# Altium schematic sheet INTERFACE.SchDoc
size A4
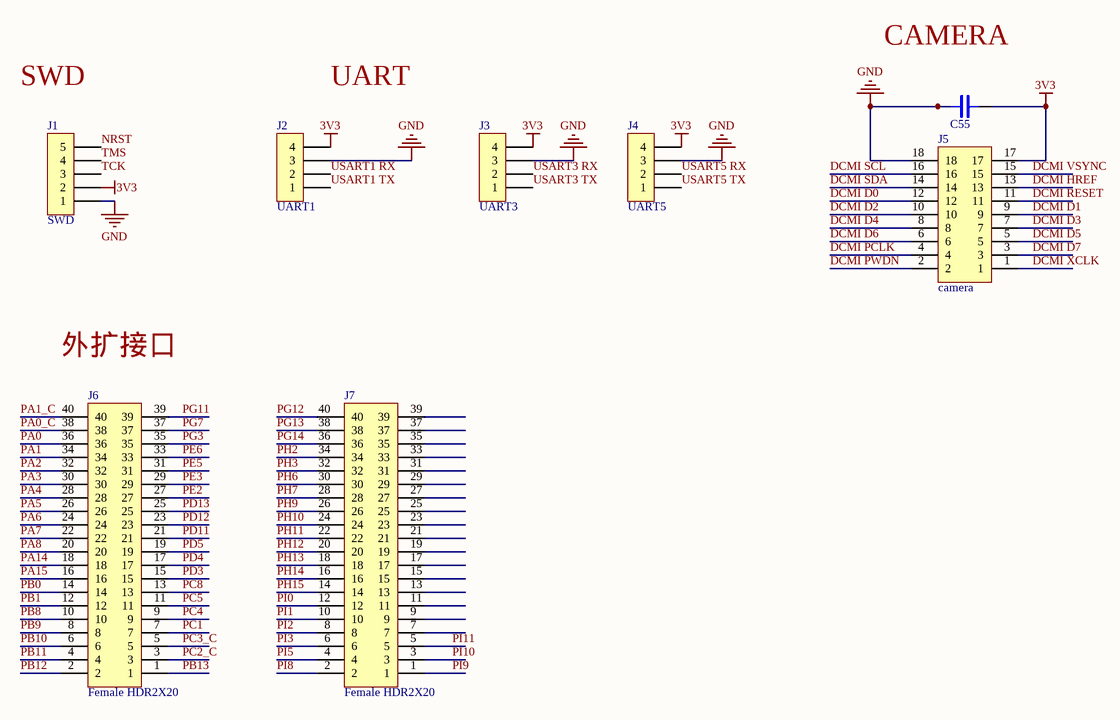
[diagram p0: INTERFACE.SchDoc]

## Parts
C55  104  [CAP-1812]  (value not drawn)
J1  SWD  [Pin HDR1X5/2mm-W]
J2  UART1  [Fe-HDR1X4/2.54-S]
J3  UART3  [Fe-HDR1X4/2.54-S]
J4  UART5  [Fe-HDR1X4/2.54-S]
J5  camera  [Fe-HDR2X9/2.54-S]
J6  Female HDR2X20  [Fe-HDR2X20/2.54-S]
J7  Female HDR2X20  [Fe-HDR2X20/2.54-S]

## Nets
3V3: C55.1 J1.2 J2.4 J3.4 J4.4 J5.17
GND: C55.2 J1.1 J2.3 J3.3 J4.3 J5.18
DCMI D0: J5.12
DCMI D1: J5.9
DCMI D2: J5.10
DCMI D3: J5.7
DCMI D4: J5.8
DCMI D5: J5.5
DCMI D6: J5.6
DCMI D7: J5.3
DCMI HREF: J5.13
DCMI PCLK: J5.4
DCMI PWDN: J5.2
DCMI RESET: J5.11
DCMI SCL: J5.16
DCMI SDA: J5.14
DCMI VSYNC: J5.15
DCMI XCLK: J5.1
NRST: J1.5
PA0: J6.36
PA0_C: J6.38
PA1: J6.34
PA1_C: J6.40
PA2: J6.32
PA3: J6.30
PA4: J6.28
PA5: J6.26
PA6: J6.24
PA7: J6.22
PA8: J6.20
PA14: J6.18
PA15: J6.16
PB0: J6.14
PB1: J6.12
PB8: J6.10
PB9: J6.8
PB10: J6.6
PB11: J6.4
PB12: J6.2
PB13: J6.1
PC1: J6.7
PC2_C: J6.3
PC3_C: J6.5
PC4: J6.9
PC5: J6.11
PC8: J6.13
PD3: J6.15
PD4: J6.17
PD5: J6.19
PD11: J6.21
PD12: J6.23
PD13: J6.25
PE2: J6.27
PE3: J6.29
PE5: J6.31
PE6: J6.33
PG3: J6.35
PG7: J6.37
PG11: J6.39
PG12: J7.40
PG13: J7.38
PG14: J7.36
PH2: J7.34
PH3: J7.32
PH6: J7.30
PH7: J7.28
PH9: J7.26
PH10: J7.24
PH11: J7.22
PH12: J7.20
PH13: J7.18
PH14: J7.16
PH15: J7.14
PI0: J7.12
PI1: J7.10
PI2: J7.8
PI3: J7.6
PI5: J7.4
PI8: J7.2
PI9: J7.1
PI10: J7.3
PI11: J7.5
TCK: J1.3
TMS: J1.4
USART1 RX: J2.2
USART1 TX: J2.1
USART3 RX: J3.2
USART3 TX: J3.1
USART5 RX: J4.2
USART5 TX: J4.1

Not connected (* = marked no-connect by the designer): J7 7 9 11 13 15 17 19 21 23 25 27 29 31 33 35 37 39

## Notes on the sheet
- SWD
- UART
- CAMERA
- 外扩接口

## Library data of the parts
C55 = CAP: Capacitor
J1 = Pin HDR1X5
J2-J4 = Female HDR1X4
J5 = Female HDR2X9